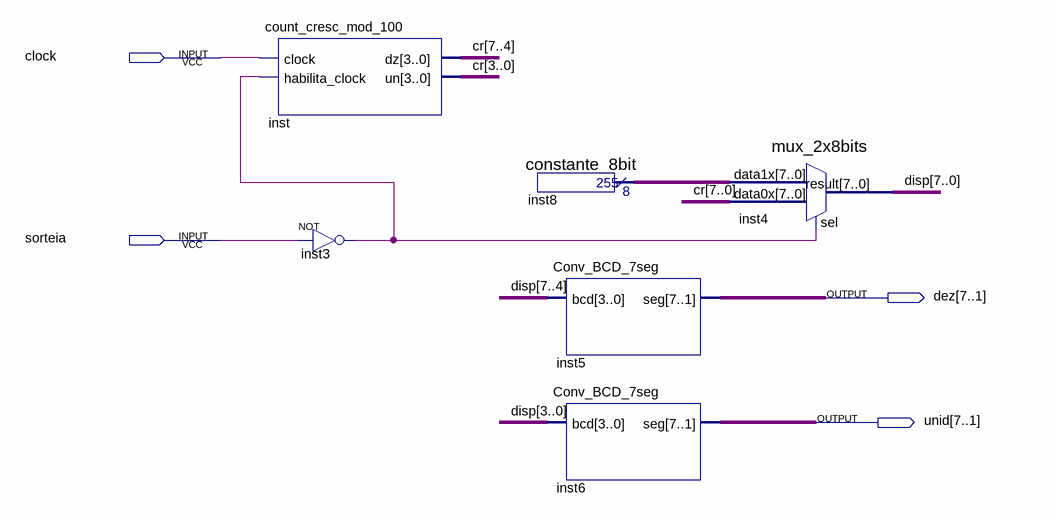
[diagram p0: schematic sheet]
// Quartus schematic plan_test.bdf as structural Verilog: 6 symbols, 4 pins
module plan_test (
  input  clock,
  input  sorteia,
  output [7:1] dez,
  output [7:1] unid
);

  wire inst3_out;
  wire [7:0] cr, disp, inst8_result;

  count_cresc_mod_100 inst (.clock(clock), .habilita_clock(inst3_out), .dz(cr[7:4]), .un(cr[3:0]));
  not inst3 (inst3_out, sorteia);
  constante_8bit inst8 (.result(inst8_result));
  Conv_BCD_7seg inst5 (.bcd(disp[7:4]), .seg(dez));
  Conv_BCD_7seg inst6 (.bcd(disp[3:0]), .seg(unid));
  mux_2x8bits inst4 (.data1x(inst8_result), .data0x(cr), .sel(inst3_out), .result(disp));
endmodule
